# Altium schematic sheet 03 AD9361_Digital.SchDoc
size A3
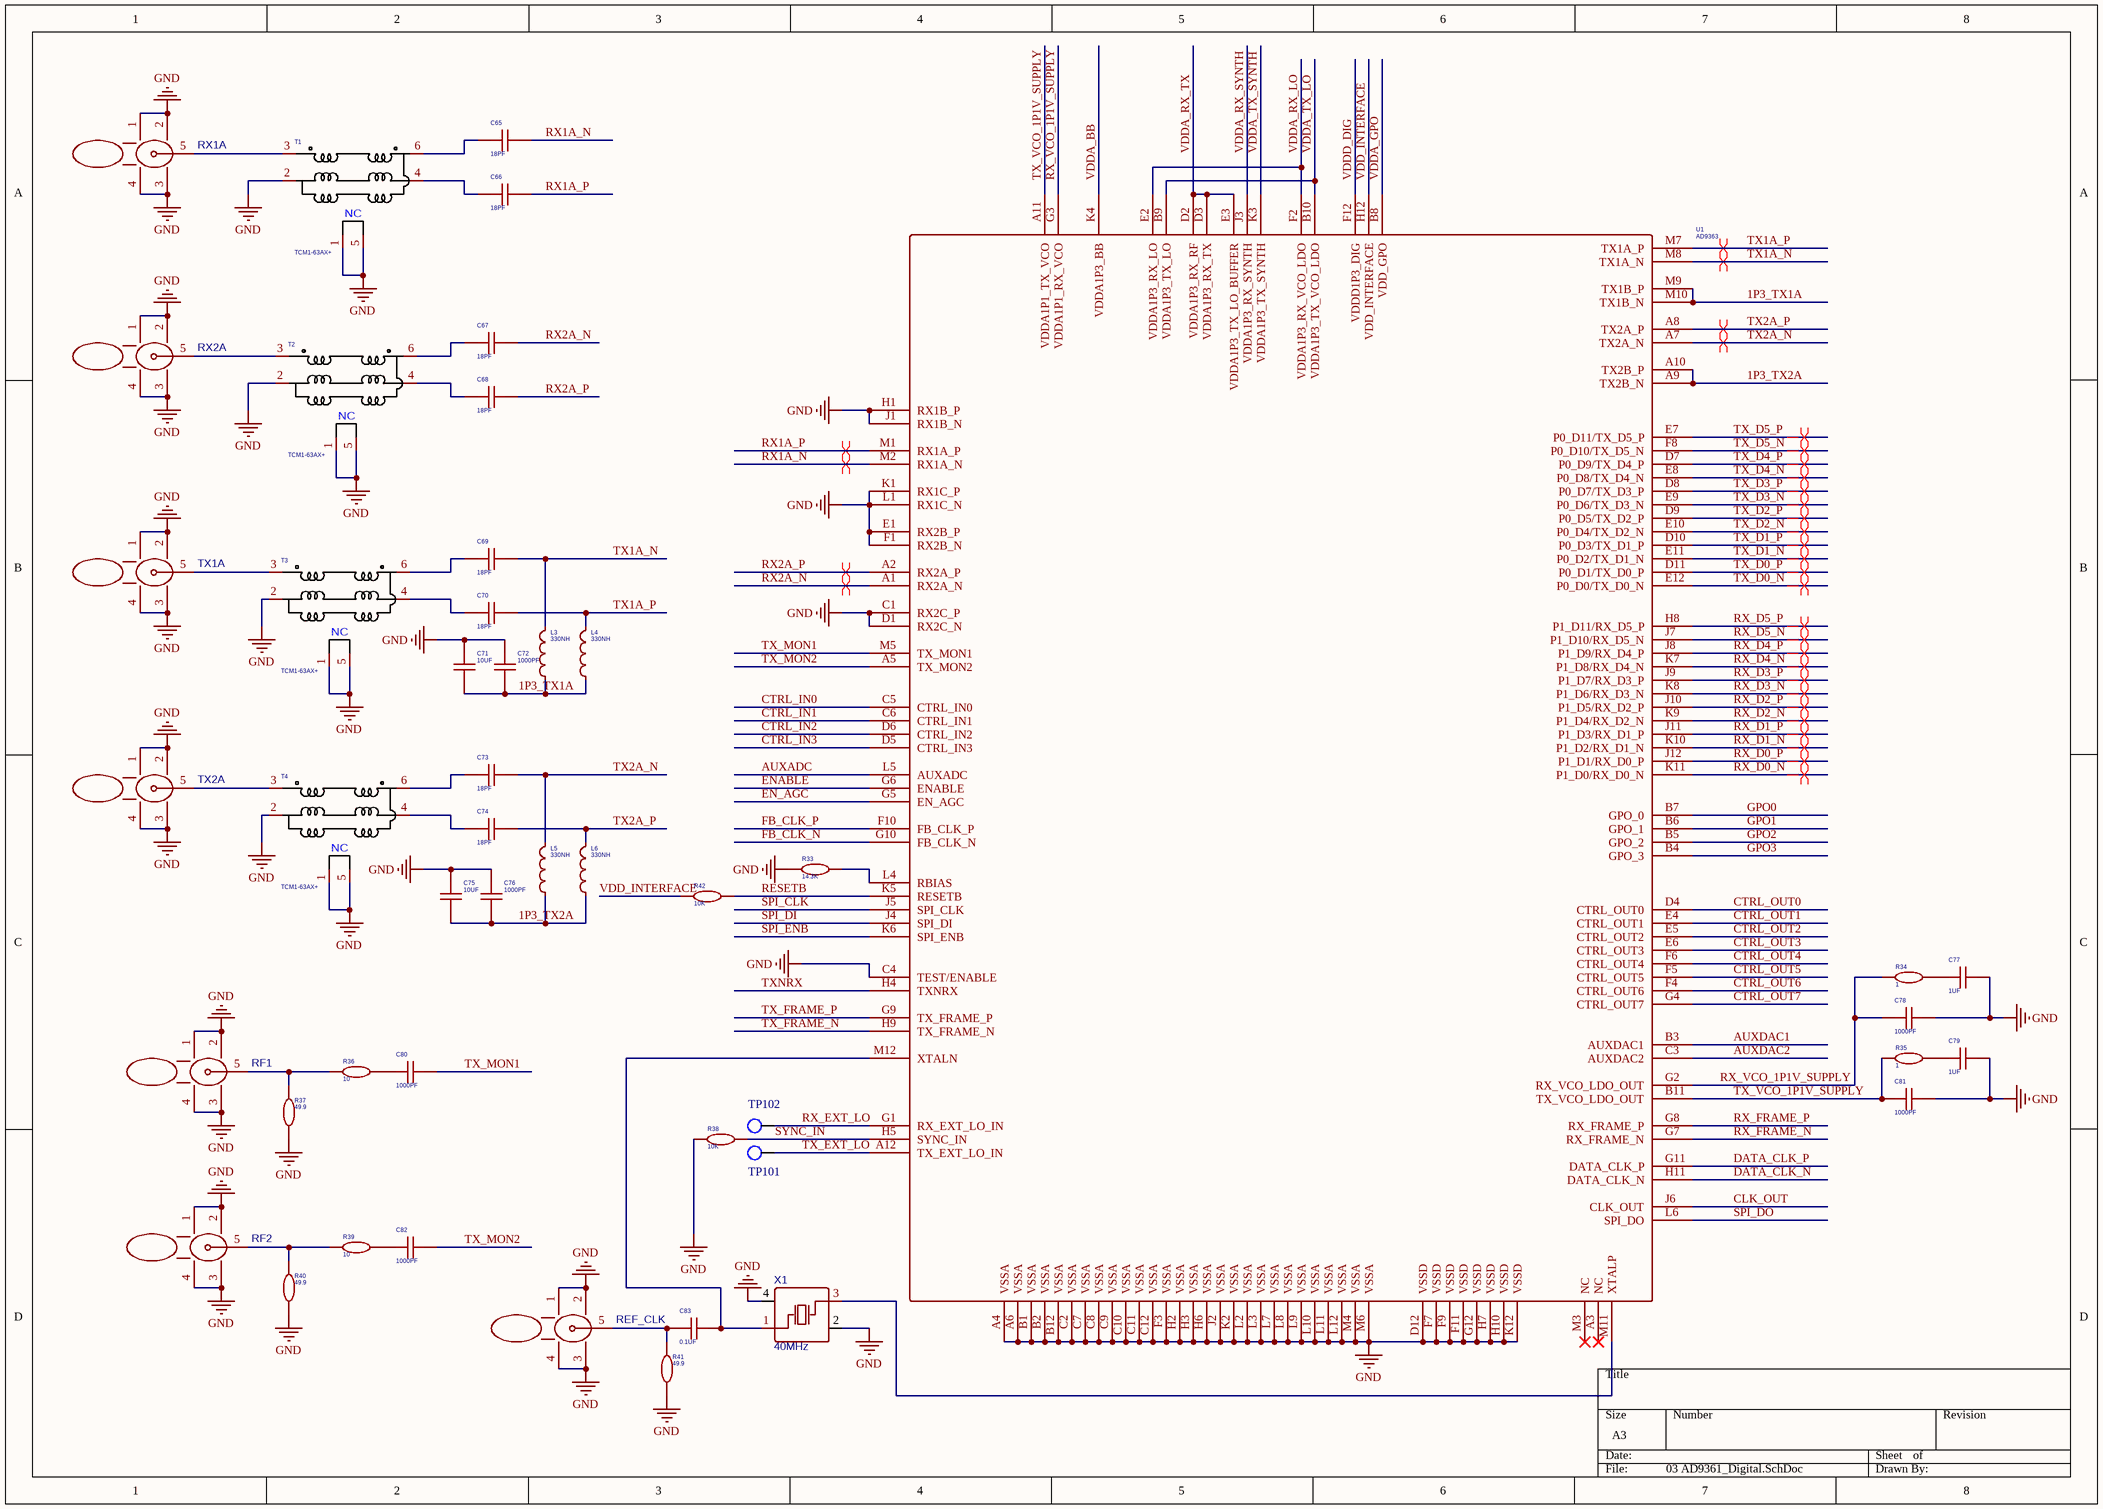
[diagram p0: 03 AD9361_Digital.SchDoc]

## Parts
C65  18PF  [C0201]
C66  18PF  [C0201]
C67  18PF  [C0201]
C68  18PF  [C0201]
C69  18PF  [C0201]
C70  18PF  [C0201]
C71  10UF  [C0402]
C72  1000PF  [C0201]
C73  18PF  [C0201]
C74  18PF  [C0201]
C75  10UF  [C0603]
C76  1000PF  [C0402]
C77  1UF  [C0402]
C78  1000PF  [C0201]
C79  1UF  [C0402]
C80  1000PF  [C0201]
C81  1000PF  [C0201]
C82  1000PF  [C0201]
C83  0.1UF  [C0402]
L3  330NH  [L0805-F]
L4  330NH  [L0805-F]
L5  330NH  [L0805-F]
L6  330NH  [L0805-F]
R33  14.3K  [C0201]
R34  1  [C0201]
R35  1  [C0201]
R36  10  [C0201]
R37  49.9  [LC-0402_R]
R38  10K  [C0201]
R39  10  [C0201]
R40  49.9  [C0201]
R41  49.9  [LC-0402_R]
R42  10K  [R0201]
REF_CLK  DOSIN-806-0010  [CNJOHNSON142-0701-201]  (value not drawn)
RF1  DOSIN-806-0010  [CNSMARAL687W375H171]  (value not drawn)
RF2  DOSIN-806-0010  [CNSMARAL687W375H171]  (value not drawn)
RX1A  DOSIN-806-0010  [CNSMARAL687W375H171]  (value not drawn)
RX2A  DOSIN-806-0010  [CNSMARAL687W375H171]  (value not drawn)
T1  TCM1-63AX+  [TSML150W160H160]
T2  TCM1-63AX+  [TSML150W160H160]
T3  TCM1-63AX+  [TSML150W160H160]
T4  TCM1-63AX+  [TSML150W160H160]
TP101  TEST POINT SURFACE  [TPC75D45]  (value not drawn)
TP102  TEST POINT SURFACE  [TPC75D45]  (value not drawn)
TX1A  DOSIN-806-0010  [CNSMARAL687W375H171]  (value not drawn)
TX2A  DOSIN-806-0010  [CNSMARAL687W375H171]  (value not drawn)
U1  AD9363  [AD936X]
X1  40MHz  [XTALNX3225]

## Nets
GND: C71.1 C72.1 C75.1 C76.1 C77.1 C78.2 C79.1 C81.2 R33.1 R37.1 R38.1 R40.1 R41.1 REF_CLK.1 REF_CLK.2 REF_CLK.3 REF_CLK.4 RF1.1 RF1.2 RF1.3 RF1.4 RF2.1 RF2.2 RF2.3 RF2.4 RX1A.1 RX1A.2 RX1A.3 RX1A.4 RX2A.1 RX2A.2 RX2A.3 RX2A.4 T1.1(NC) T1.2 T1.5(NC) T2.1(NC) T2.2 T2.5(NC) T3.1(NC) T3.2 T3.5(NC) T4.1(NC) T4.2 T4.5(NC) TX1A.1 TX1A.2 TX1A.3 TX1A.4 TX2A.1 TX2A.2 TX2A.3 TX2A.4 U1.A4(VSSA) U1.A6(VSSA) U1.B1(VSSA) U1.B2(VSSA) U1.B12(VSSA) U1.C1(RX2C_P) U1.C2(VSSA) U1.C4(TEST/ENABLE) U1.C7(VSSA) U1.C8(VSSA) U1.C9(VSSA) U1.C10(VSSA) U1.C11(VSSA) U1.C12(VSSA) U1.D1(RX2C_N) U1.D12(VSSD) U1.E1(RX2B_P) U1.F1(RX2B_N) U1.F3(VSSA) U1.F7(VSSD) U1.F9(VSSD) U1.F11(VSSD) U1.G12(VSSD) U1.H1(RX1B_P) U1.H2(VSSA) U1.H3(VSSA) U1.H6(VSSA) U1.H7(VSSD) U1.H10(VSSD) U1.J1(RX1B_N) U1.J2(VSSA) U1.K1(RX1C_P) U1.K2(VSSA) U1.K12(VSSD) U1.L1(RX1C_N) U1.L2(VSSA) U1.L3(VSSA) U1.L7(VSSA) U1.L8(VSSA) U1.L9(VSSA) U1.L10(VSSA) U1.L11(VSSA) U1.L12(VSSA) U1.M4(VSSA) U1.M6(VSSA) X1.2(GND) X1.4(GND)
1P3_TX1A: C71.2 C72.2 L3.1 L4.1 U1.M9(TX1B_P) U1.M10(TX1B_N)
1P3_TX2A: C75.2 C76.2 L5.1 L6.1 U1.A9(TX2B_N) U1.A10(TX2B_P)
AUXADC: U1.L5(AUXADC)
AUXDAC1: U1.B3(AUXDAC1)
AUXDAC2: U1.C3(AUXDAC2)
CLK_OUT: U1.J6(CLK_OUT)
CTRL_IN0: U1.C5(CTRL_IN0)
CTRL_IN1: U1.C6(CTRL_IN1)
CTRL_IN2: U1.D6(CTRL_IN2)
CTRL_IN3: U1.D5(CTRL_IN3)
CTRL_OUT0: U1.D4(CTRL_OUT0)
CTRL_OUT1: U1.E4(CTRL_OUT1)
CTRL_OUT2: U1.E5(CTRL_OUT2)
CTRL_OUT3: U1.E6(CTRL_OUT3)
CTRL_OUT4: U1.F6(CTRL_OUT4)
CTRL_OUT5: U1.F5(CTRL_OUT5)
CTRL_OUT6: U1.F4(CTRL_OUT6)
CTRL_OUT7: U1.G4(CTRL_OUT7)
DATA_CLK_N: U1.H11(DATA_CLK_N)
DATA_CLK_P: U1.G11(DATA_CLK_P)
EN_AGC: U1.G5(EN_AGC)
ENABLE: U1.G6(ENABLE)
FB_CLK_N: U1.G10(FB_CLK_N)
FB_CLK_P: U1.F10(FB_CLK_P)
GPO0: U1.B7(GPO_0)
GPO1: U1.B6(GPO_1)
GPO2: U1.B5(GPO_2)
GPO3: U1.B4(GPO_3)
RESETB: R42.2 U1.K5(RESETB)
RX1A_N: C65.1 U1.M2(RX1A_N)
RX1A_P: C66.1 U1.M1(RX1A_P)
RX2A_N: C67.1 U1.A1(RX2A_N)
RX2A_P: C68.1 U1.A2(RX2A_P)
RX_D0_N: U1.K11(P1_D0/RX_D0_N)
RX_D0_P: U1.J12(P1_D1/RX_D0_P)
RX_D1_N: U1.K10(P1_D2/RX_D1_N)
RX_D1_P: U1.J11(P1_D3/RX_D1_P)
RX_D2_N: U1.K9(P1_D4/RX_D2_N)
RX_D2_P: U1.J10(P1_D5/RX_D2_P)
RX_D3_N: U1.K8(P1_D6/RX_D3_N)
RX_D3_P: U1.J9(P1_D7/RX_D3_P)
RX_D4_N: U1.K7(P1_D8/RX_D4_N)
RX_D4_P: U1.J8(P1_D9/RX_D4_P)
RX_D5_N: U1.J7(P1_D10/RX_D5_N)
RX_D5_P: U1.H8(P1_D11/RX_D5_P)
RX_EXT_LO: TP102.1(TP) U1.G1(RX_EXT_LO_IN)
RX_FRAME_N: U1.G7(RX_FRAME_N)
RX_FRAME_P: U1.G8(RX_FRAME_P)
RX_VCO_1P1V_SUPPLY: C78.1 R34.1 U1.G2(RX_VCO_LDO_OUT) U1.G3(VDDA1P1_RX_VCO)
SPI_CLK: U1.J5(SPI_CLK)
SPI_DI: U1.J4(SPI_DI)
SPI_DO: U1.L6(SPI_DO)
SPI_ENB: U1.K6(SPI_ENB)
SYNC_IN: R38.2 U1.H5(SYNC_IN)
TX1A_N: C69.1 L3.2 U1.M8(TX1A_N)
TX1A_P: C70.1 L4.2 U1.M7(TX1A_P)
TX2A_N: C73.1 L5.2 U1.A7(TX2A_N)
TX2A_P: C74.1 L6.2 U1.A8(TX2A_P)
TX_D0_N: U1.E12(P0_D0/TX_D0_N)
TX_D0_P: U1.D11(P0_D1/TX_D0_P)
TX_D1_N: U1.E11(P0_D2/TX_D1_N)
TX_D1_P: U1.D10(P0_D3/TX_D1_P)
TX_D2_N: U1.E10(P0_D4/TX_D2_N)
TX_D2_P: U1.D9(P0_D5/TX_D2_P)
TX_D3_N: U1.E9(P0_D6/TX_D3_N)
TX_D3_P: U1.D8(P0_D7/TX_D3_P)
TX_D4_N: U1.E8(P0_D8/TX_D4_N)
TX_D4_P: U1.D7(P0_D9/TX_D4_P)
TX_D5_N: U1.F8(P0_D10/TX_D5_N)
TX_D5_P: U1.E7(P0_D11/TX_D5_P)
TX_EXT_LO: TP101.1(TP) U1.A12(TX_EXT_LO_IN)
TX_FRAME_N: U1.H9(TX_FRAME_N)
TX_FRAME_P: U1.G9(TX_FRAME_P)
TX_MON1: C80.2 U1.M5(TX_MON1)
TX_MON2: C82.2 U1.A5(TX_MON2)
TX_VCO_1P1V_SUPPLY: C81.1 R35.1 U1.A11(VDDA1P1_TX_VCO) U1.B11(TX_VCO_LDO_OUT)
TXNRX: U1.H4(TXNRX)
VDD_INTERFACE: R42.1 U1.H12(VDD_INTERFACE)
VDDA_BB: U1.K4(VDDA1P3_BB)
VDDA_GPO: U1.B8(VDD_GPO)
VDDA_RX_LO: U1.E2(VDDA1P3_RX_LO) U1.F2(VDDA1P3_RX_VCO_LDO)
VDDA_RX_SYNTH: U1.J3(VDDA1P3_RX_SYNTH)
VDDA_RX_TX: U1.D2(VDDA1P3_RX_RF) U1.D3(VDDA1P3_RX_TX) U1.E3(VDDA1P3_TX_LO_BUFFER)
VDDA_TX_LO: U1.B9(VDDA1P3_TX_LO) U1.B10(VDDA1P3_TX_VCO_LDO)
VDDA_TX_SYNTH: U1.K3(VDDA1P3_TX_SYNTH)
VDDD_DIG: U1.F12(VDDD1P3_DIG)
NetC65_2: C65.2 T1.6
NetC66_2: C66.2 T1.4
NetC67_2: C67.2 T2.6
NetC68_2: C68.2 T2.4
NetC69_2: C69.2 T3.6
NetC70_2: C70.2 T3.4
NetC73_2: C73.2 T4.6
NetC74_2: C74.2 T4.4
NetC77_2: C77.2 R34.2
NetC79_2: C79.2 R35.2
NetC80_1: C80.1 R36.2
NetC82_1: C82.1 R39.2
NetC83_1: C83.1 U1.M12(XTALN) X1.1(OSC1)
NetC83_2: C83.2 R41.2 REF_CLK.5
NetR33_2: R33.2 U1.L4(RBIAS)
NetR36_1: R36.1 R37.2 RF1.5
NetR39_1: R39.1 R40.2 RF2.5
NetRX1A_5: RX1A.5 T1.3
NetRX2A_5: RX2A.5 T2.3
NetT3_3: T3.3 TX1A.5
NetT4_3: T4.3 TX2A.5
NetU1_M11: U1.M11(XTALP) X1.3(OSC2)

Not connected (* = marked no-connect by the designer): U1 A3(NC)* M3(NC)*

## Layout directives
differential pair: RX1A_N, RX1A_P, RX2A_N, RX2A_P, RX_D0_N, RX_D0_P, RX_D1_N, RX_D1_P, RX_D2_N, RX_D2_P, RX_D3_N, RX_D3_P, RX_D4_N, RX_D4_P, RX_D5_N, RX_D5_P, TX1A_N, TX1A_P, TX2A_N, TX2A_P, TX_D0_N, TX_D0_P, TX_D1_N, TX_D1_P, TX_D2_N, TX_D2_P, TX_D3_N, TX_D3_P, TX_D4_N, TX_D4_P, TX_D5_N, TX_D5_P

## Library data of the parts
C65-C70 C72-C74 C76 C80 C82 = 18PF: BOM_Manufacturer: WTC; BOM_Manufacturer Part: 0402B104K160; nameAlias: Capacitance; BOM_Supplier: LCSC; BOM_Supplier Part: C83056; spicePre: C; spiceSymbolName: 0402B104K160
C71 C75 = 10UF: BOM_Manufacturer: WTC; BOM_Manufacturer Part: 0402B104K160; nameAlias: Capacitance; BOM_Supplier: LCSC; BOM_Supplier Part: C83056; spicePre: C; spiceSymbolName: 0402B104K160
C77 C79 C83 = 0.1UF: BOM_Manufacturer: WTC; BOM_Manufacturer Part: 0402B104K160; nameAlias: Capacitance; BOM_Supplier: LCSC; BOM_Supplier Part: C83056; spicePre: C; spiceSymbolName: 0402B104K160
C78 C81 = 100PF: BOM_Manufacturer: WTC; BOM_Manufacturer Part: 0402B104K160; nameAlias: Capacitance; BOM_Supplier: LCSC; BOM_Supplier Part: C83056; spicePre: C; spiceSymbolName: 0402B104K160
L3-L6 = 330NH: BOM_Manufacturer: Sunlord; BOM_Manufacturer Part: GZ1608D121TF; nameAlias: Value; SMT Type: Extend; BOM_Supplier: LCSC; BOM_Supplier Part: C12391; BOM_JLCPCB SMD: Yes; spicePre: L; spiceSymbolName: GZ1608D121TF-C12391
R33 R38 R42 = 10K: BOM_Manufacturer: YAGEO; BOM_Manufacturer Part: RC0402FR-0780R6L; nameAlias: Resistance (Ohms); Contributor: LCSC; BOM_Supplier: LCSC; BOM_Supplier Part: C185392; spicePre: R; spiceSymbolName: RC0402FR-0780R6L
R34-R37 R39-R41 = 1: BOM_Manufacturer: YAGEO; BOM_Manufacturer Part: RC0402FR-0780R6L; nameAlias: Resistance (Ohms); Contributor: LCSC; BOM_Supplier: LCSC; BOM_Supplier Part: C185392; spicePre: R; spiceSymbolName: RC0402FR-0780R6L
REF_CLK RF1 RF2 RX1A RX2A TX1A TX2A = DOSIN-806-0010: BOM_Manufacturer: dosinconn; Contributor: LCSC; BOM_Supplier: LCSC; BOM_Supplier Part: C521221; BOM_Manufacturer Part: DOSIN-806-0010; spicePre: R; spiceSymbolName: DOSIN-806-0010
T1-T4 = TCM1-63AX+: Contributor: GaAs; spicePre: T; spiceSymbolName: TCM1-63AX+
TP101 TP102 = TEST POINT SURFACE_1
U1 = AD9363: Contributor: fumanduo; spicePre: U; spiceSymbolName: AD9363_PLUTO
X1 = 30MHz: BOM_Manufacturer: NDK; BOM_Manufacturer Part: NX3225SA-30M; nameAlias: Frequency; Contributor: LCSC; BOM_Supplier: LCSC; BOM_Supplier Part: C139739; spicePre: X; spiceSymbolName: NX3225SA-30M